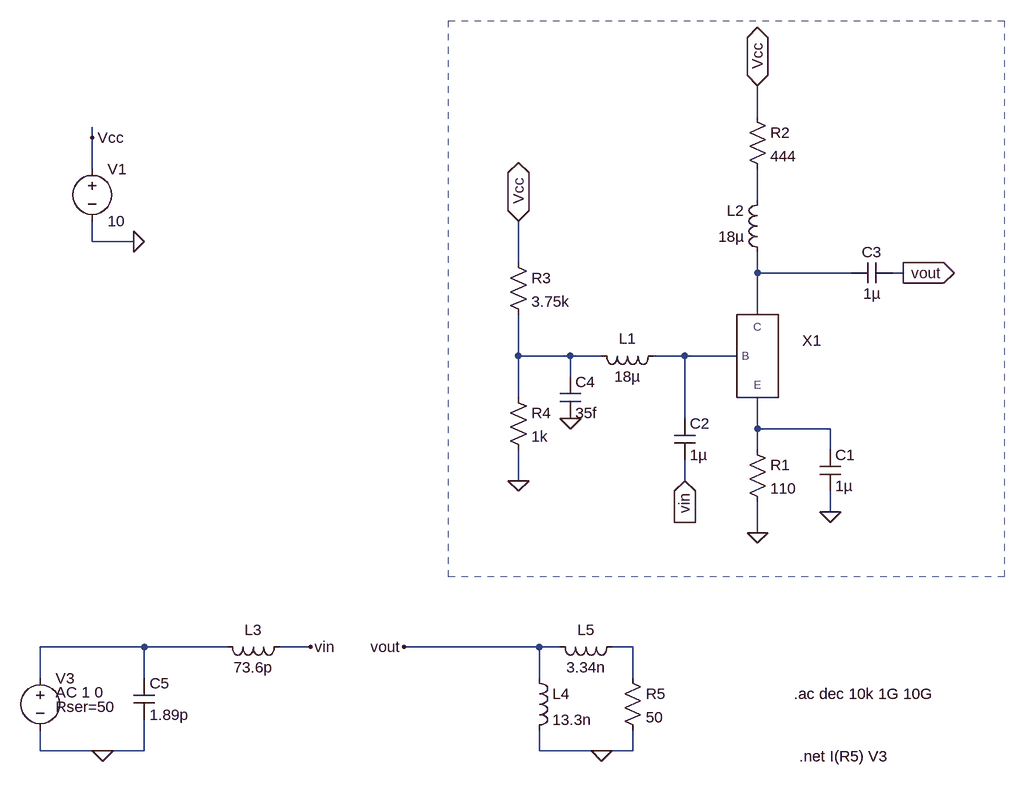
[diagram p0: schematic Draft3.asc]
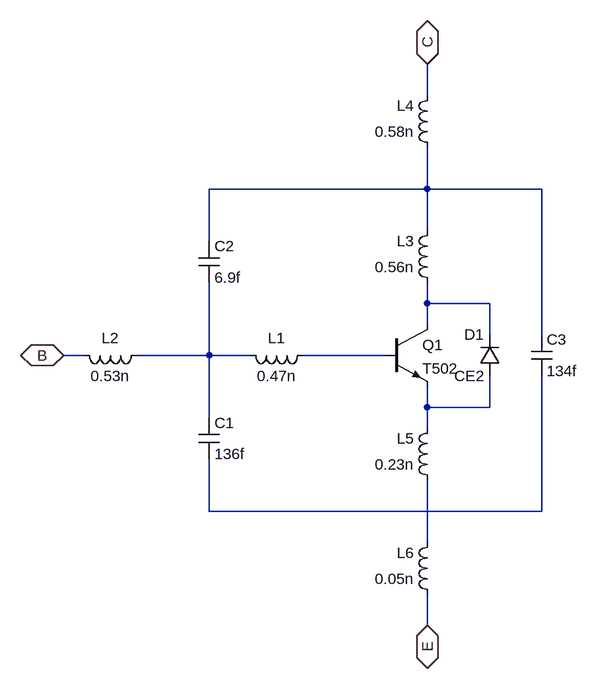
[diagram p1: sub-circuit transistorreal.asc]
Draft3.asc, the LTspice schematic file:
Version 4
SHEET 1 880 856
WIRE 192 -144 192 -192
WIRE -832 -112 -832 -128
WIRE -832 -64 -832 -112
WIRE 192 -16 192 -64
WIRE -832 48 -832 16
WIRE -768 48 -832 48
WIRE -176 80 -176 16
WIRE 192 96 192 64
WIRE 336 96 192 96
WIRE 416 96 400 96
WIRE 192 160 192 96
WIRE -176 224 -176 160
WIRE -96 224 -176 224
WIRE -48 224 -96 224
WIRE 80 224 32 224
WIRE 160 224 80 224
WIRE -96 256 -96 224
WIRE -176 288 -176 224
WIRE 80 320 80 224
WIRE 192 336 192 288
WIRE 304 336 192 336
WIRE 192 368 192 336
WIRE 304 368 304 336
WIRE -176 416 -176 368
WIRE 80 416 80 384
WIRE 304 464 304 432
WIRE 192 496 192 448
WIRE -752 672 -912 672
WIRE -624 672 -752 672
WIRE -496 672 -544 672
WIRE -144 672 -352 672
WIRE -112 672 -144 672
WIRE 0 672 -32 672
WIRE -912 720 -912 672
WIRE -752 720 -752 672
WIRE -144 720 -144 672
WIRE 0 720 0 672
WIRE -912 832 -912 800
WIRE -816 832 -912 832
WIRE -752 832 -752 784
WIRE -752 832 -816 832
WIRE -144 832 -144 800
WIRE -48 832 -144 832
WIRE 0 832 0 800
WIRE 0 832 -48 832
FLAG -176 16 Vcc
IOPIN -176 16 BiDir
FLAG 192 -192 Vcc
IOPIN 192 -192 BiDir
FLAG 80 416 vin
IOPIN 80 416 In
FLAG 416 96 vout
IOPIN 416 96 Out
FLAG -768 48 0
FLAG -832 -112 Vcc
FLAG -352 672 vout
FLAG -496 672 vin
FLAG -816 832 0
FLAG -48 832 0
FLAG -96 320 0
FLAG -176 416 0
FLAG 192 496 0
FLAG 304 464 0
SYMBOL TransistorReal 176 208 R0
SYMATTR InstName X1
SYMBOL ind 48 208 R90
WINDOW 0 5 56 VBottom 2
WINDOW 3 32 56 VTop 2
SYMATTR InstName L1
SYMATTR Value 18µ
SYMBOL ind 208 80 R180
WINDOW 0 36 80 Left 2
WINDOW 3 36 40 Left 2
SYMATTR InstName L2
SYMATTR Value 18µ
SYMBOL Res 176 352 R0
SYMATTR InstName R1
SYMATTR Value 110
SYMBOL Res 176 -160 R0
SYMATTR InstName R2
SYMATTR Value 444
SYMBOL Res -192 64 R0
SYMATTR InstName R3
SYMATTR Value 3.75k
SYMBOL Res -192 272 R0
SYMATTR InstName R4
SYMATTR Value 1k
SYMBOL Cap 288 368 R0
SYMATTR InstName C1
SYMATTR Value 1µ
SYMBOL Cap 64 320 R0
SYMATTR InstName C2
SYMATTR Value 1µ
SYMBOL Cap 400 80 R90
WINDOW 0 0 32 VBottom 2
WINDOW 3 32 32 VTop 2
SYMATTR InstName C3
SYMATTR Value 1µ
SYMBOL Voltage -832 -80 R0
SYMATTR InstName V1
SYMATTR Value 10
SYMBOL Voltage -912 704 R0
WINDOW 123 24 38 Left 2
WINDOW 39 24 60 Left 2
SYMATTR Value2 AC 1 0
SYMATTR SpiceLine Rser=50
SYMATTR InstName V3
SYMATTR Value ""
SYMBOL Cap -768 720 R0
SYMATTR InstName C5
SYMATTR Value 1.89p
SYMBOL ind -528 656 R90
WINDOW 0 5 56 VBottom 2
WINDOW 3 32 56 VTop 2
SYMATTR InstName L3
SYMATTR Value 73.6p
SYMBOL Res -16 704 R0
SYMATTR InstName R5
SYMATTR Value 50
SYMBOL ind -160 704 R0
SYMATTR InstName L4
SYMATTR Value 13.3n
SYMBOL ind -16 656 R90
WINDOW 0 5 56 VBottom 2
WINDOW 3 32 56 VTop 2
SYMATTR InstName L5
SYMATTR Value 3.34n
SYMBOL Cap -112 256 R0
SYMATTR InstName C4
SYMATTR Value 35f
TEXT 248 744 Left 2 !.ac dec 10k 1G 10G
TEXT 256 840 Left 2 !.net I(R5) V3
RECTANGLE Normal -284 -292 572 564 2

transistorreal.asc, the sub-circuit schematic file:
Version 4
SHEET 1 880 872
WIRE 448 -16 448 -64
WIRE 448 128 448 64
WIRE 448 128 112 128
WIRE 624 128 448 128
WIRE 448 192 448 128
WIRE 112 208 112 128
WIRE 448 304 448 272
WIRE 544 304 448 304
WIRE 448 336 448 304
WIRE 544 352 544 304
WIRE 624 352 624 128
WIRE -80 384 -112 384
WIRE 112 384 112 272
WIRE 112 384 0 384
WIRE 176 384 112 384
WIRE 384 384 256 384
WIRE 448 464 448 432
WIRE 544 464 544 416
WIRE 544 464 448 464
WIRE 112 480 112 384
WIRE 448 496 448 464
WIRE 112 624 112 544
WIRE 624 624 624 416
WIRE 624 624 112 624
WIRE 448 672 448 576
WIRE 448 800 448 752
FLAG -112 384 B
IOPIN -112 384 BiDir
FLAG 448 -64 C
IOPIN 448 -64 BiDir
FLAG 448 800 E
IOPIN 448 800 BiDir
SYMBOL npn 384 336 R0
SYMATTR InstName Q1
SYMATTR Value T502
SYMBOL ind 272 368 R90
WINDOW 0 5 56 VBottom 2
WINDOW 3 32 56 VTop 2
SYMATTR InstName L1
SYMATTR Value 0.47n
SYMBOL ind 16 368 R90
WINDOW 0 5 56 VBottom 2
WINDOW 3 32 56 VTop 2
SYMATTR InstName L2
SYMATTR Value 0.53n
SYMBOL ind 464 288 R180
WINDOW 0 36 80 Left 2
WINDOW 3 36 40 Left 2
SYMATTR InstName L3
SYMATTR Value 0.56n
SYMBOL ind 464 80 R180
WINDOW 0 36 80 Left 2
WINDOW 3 36 40 Left 2
SYMATTR InstName L4
SYMATTR Value 0.58n
SYMBOL ind 464 592 R180
WINDOW 0 36 80 Left 2
WINDOW 3 36 40 Left 2
SYMATTR InstName L5
SYMATTR Value 0.23n
SYMBOL ind 464 768 R180
WINDOW 0 36 80 Left 2
WINDOW 3 36 40 Left 2
SYMATTR InstName L6
SYMATTR Value 0.05n
SYMBOL Cap 96 480 R0
SYMATTR InstName C1
SYMATTR Value 136f
SYMBOL Cap 96 208 R0
SYMATTR InstName C2
SYMATTR Value 6.9f
SYMBOL Cap 608 352 R0
SYMATTR InstName C3
SYMATTR Value 134f
SYMBOL Diode 560 416 R180
WINDOW 0 24 64 Left 2
WINDOW 3 24 0 Left 2
SYMATTR InstName D1
SYMATTR Value CE2

The netlist it stands for:
* Draft3.asc
XX1 N004 N002 N005 transistorreal
L1 N004 N003 18µ
L2 N002 N001 18µ
R1 N005 0 110
R2 Vcc N001 444
R3 Vcc N003 3.75k
R4 N003 0 1k
C1 N005 0 1µ
C2 N004 vin 1µ
C3 vout N002 1µ
V1 Vcc 0 10
V3 N006 0 AC 1 0 Rser=50
C5 N006 0 1.89p
L3 vin N006 73.6p
R5 N007 0 50
L4 vout 0 13.3n
L5 N007 vout 3.34n
C4 N003 0 35f

* block symbol definitions
.subckt transistorreal B C E
Q1 N002 N004 N005 0 T502
L1 N004 N003 0.47n
L2 N003 B 0.53n
L3 N002 N001 0.56n
L4 N001 C 0.58n
L5 N007 N005 0.23n
L6 E N007 0.05n
C1 N003 N006 136f
C2 N001 N003 6.9f
C3 N001 N006 134f
D1 N005 N002 CE2
.ends transistorreal

.model D D
.lib standard.dio
.model NPN NPN
.model PNP PNP
.lib standard.bjt
.ac dec 10k 1G 10G
.net I(R5) V3
.backanno
.end